# Altium schematic sheet Smokehouse_thermometer.SchDoc
size A4
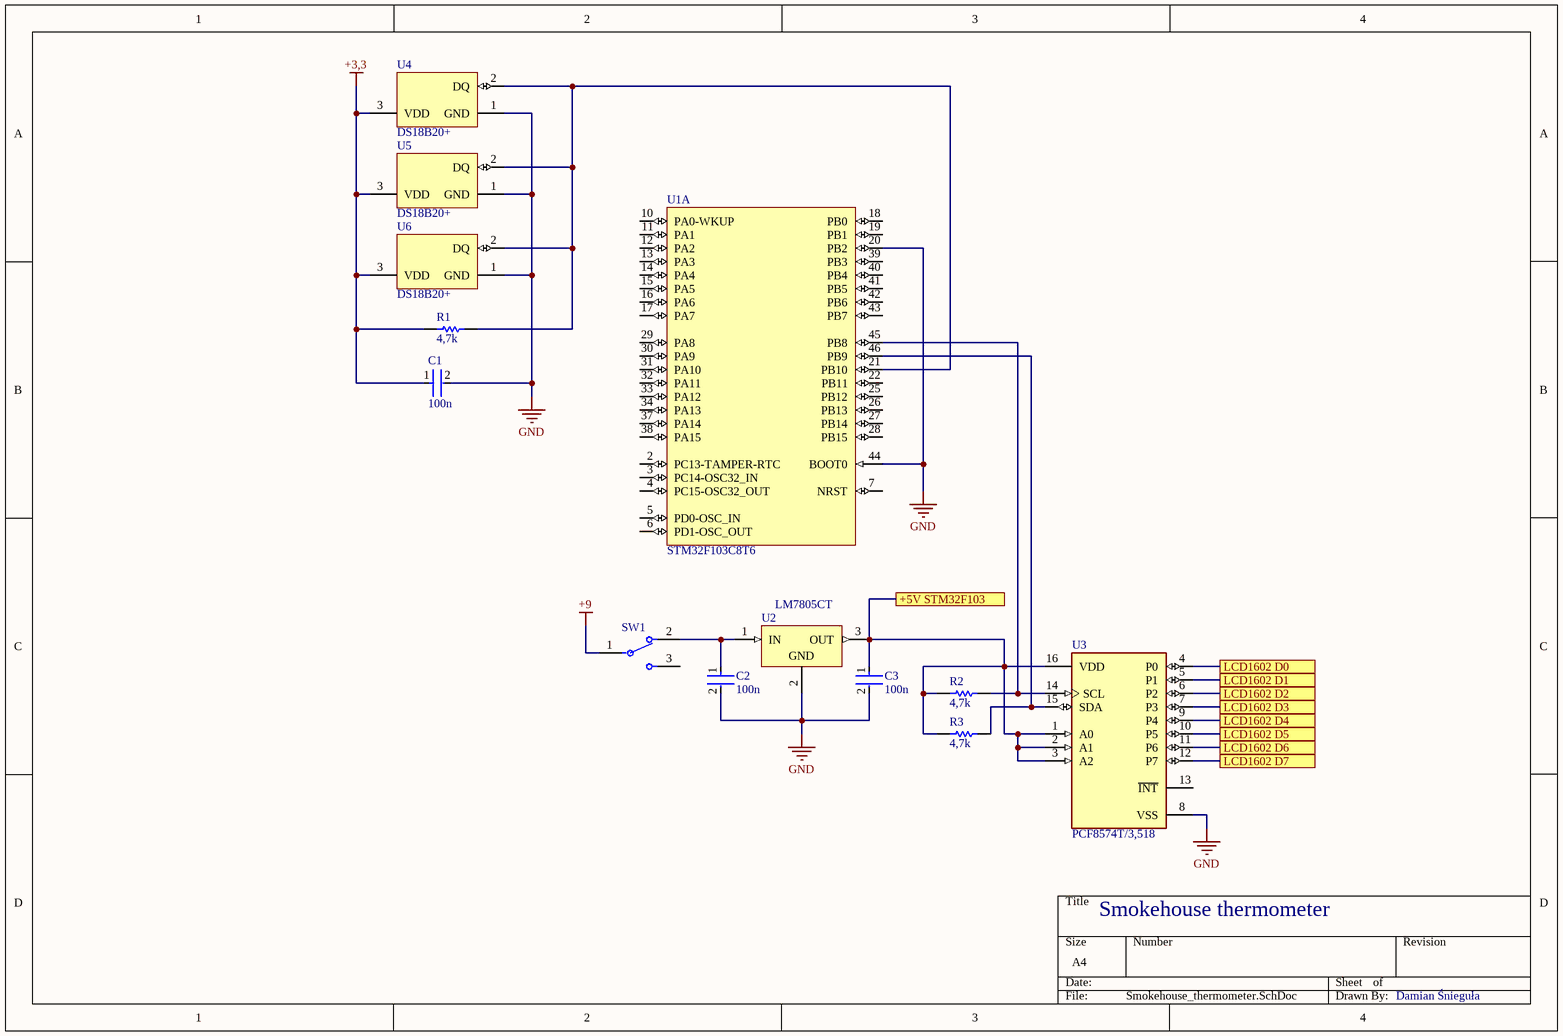
[diagram p0: Smokehouse_thermometer.SchDoc]

## Parts
C1  100n  [FP-C0402-BB-MFG]
C2  100n  [FP-C0402-BB-MFG]
C3  100n  [FP-C0402-BB-MFG]
R1  4,7k  [RESC1609X50X30NL8T20]
R2  4,7k  [RESC1609X50X30NL8T20]
R3  4,7k  [RESC1609X50X30NL8T20]
SW1  A105SYCB04  [FP-A105SYCB04-MFG]  (value not drawn)
U1  STM32F103C8T6  [STM-LQFP48_L]  (part A of 2)
U2  LM7805CT  [FAIR-TO-220-3]
U3  PCF8574T/3,518  [FP-SOT162-1-MFG]
U4  DS18B20+  [Q3+1]
U5  DS18B20+  [Q3+1]
U6  DS18B20+  [Q3+1]

## Ports
+5V STM32F103, LCD1602 D0, LCD1602 D1, LCD1602 D2, LCD1602 D3, LCD1602 D4, LCD1602 D5, LCD1602 D6, LCD1602 D7

## Nets
+3,3: C1.1 R1.1 U4.3(VDD) U5.3(VDD) U6.3(VDD)
+9: SW1.1
GND: C1.2 C2.2 C3.2 U1.20(PB2) U1.44(BOOT0) U2.2(GND) U3.8(VSS) U4.1(GND) U5.1(GND) U6.1(GND)
+5V STM32F103: C3.1 R2.1 R3.1 U2.3(OUT) U3.1(A0) U3.2(A1) U3.3(A2) U3.16(VDD) ; port +5V STM32F103
LCD1602 D0: U3.4(P0) ; port LCD1602 D0
LCD1602 D1: U3.5(P1) ; port LCD1602 D1
LCD1602 D2: U3.6(P2) ; port LCD1602 D2
LCD1602 D3: U3.7(P3) ; port LCD1602 D3
LCD1602 D4: U3.9(P4) ; port LCD1602 D4
LCD1602 D5: U3.10(P5) ; port LCD1602 D5
LCD1602 D6: U3.11(P6) ; port LCD1602 D6
LCD1602 D7: U3.12(P7) ; port LCD1602 D7
NetC2_1: C2.1 SW1.2 U2.1(IN)
NetR1_2: R1.2 U1.21(PB10) U4.2(DQ) U5.2(DQ) U6.2(DQ)
NetR2_2: R2.2 U1.45(PB8) U3.14(SCL)
NetR3_2: R3.2 U1.46(PB9) U3.15(SDA)

Not connected (* = marked no-connect by the designer): SW1 3; U1 2(PC13-TAMPER-RTC) 3(PC14-OSC32_IN) 4(PC15-OSC32_OUT) 5(PD0-OSC_IN) 6(PD1-OSC_OUT) 7(NRST) 10(PA0-WKUP) 11(PA1) 12(PA2) 13(PA3) 14(PA4) 15(PA5) 16(PA6) 17(PA7) 18(PB0) 19(PB1) 22(PB11) 25(PB12) 26(PB13) 27(PB14) 28(PB15) 29(PA8) 30(PA9) 31(PA10) 32(PA11) 33(PA12) 34(PA13) 37(PA14) 38(PA15) 39(PB3) 40(PB4) 41(PB5) 42(PB6) 43(PB7); U3 13(~{INT})

## Notes on the sheet
- Smokehouse thermometer
- Damian Śnieguła

## Library data of the parts
C1-C3 = CMP-2008-02046-2: CAP CER 0.1UF 10V X5R 0402; Manufacturer: Kemet; Manufacturer Part Number: C0402C104K8PACTU; Material: Ceramic; Capacitance: 0.10 μF; Temperature Coefficient: 15%; Description: C0402 0.10 μF X5R 10.00% 10 V; Tolerance: 0.1; Value: 0.10 μF; Package: C0402-BB; Temperature: -55°C to +125°C; ComponentLink2Description: Datasheet; Temperature Characteristic: X5R; Device Class L1: Passive Components; Height: 0.55mm; Lead Free: Yes; ComponentLink2URL: https://content.kemet.com/datasheets/KEM_C1002_X7R_SMD.pdf; Device Class L2: Capacitors; Temperature Range Low: -55°C; Temperature Range High: +125°C; RoHS: TRUE; Octopart: https://octopart.com/c0402c104k8pactu-kemet-140039; Automotive: No; Mouser Description: Capacitor 100 nF 10 VDC 0402; Category: Cap; Voltage Rating: 10 V; Digikey Description: CAP CER 0.1UF 10V X5R 0402; Ipc Land Pattern Name: CAPC10050X50; Device Class L3: Ceramic Capacitors
R1-R3 = CMP-2000-03816-5: Chip Resistor, 0 Ohm, Jumper, 100 mW, -55 to 155 degC, 0603 (1608 Metric), RoHS, Tape and Reel; Manufacturer: Vishay Semiconductor; Voltage Rating: 75 V; Package Quantity: 5000; DatasheetVersion: 06/2012; Min Operating Temperature: -55 degC; ComponentLink1URL: http://www.vishay.com/; Mounting Technology: Surface Mount; Height: 0.45 mm; ComponentLink1Description: Manufacturer URL; REACH SVHC: Unknown; PackageReference: 0603; Packaging: Tape and Reel; Max Operating Temperature: 155 degC; Mount: Surface Mount; ComponentLink2Description: Datasheet; PackageDescription: 2-Pin Surface Mount Device, Body 1.575 x 0.85 mm; Length: 1.55 mm; ComponentLink2URL: http://www.vishay.com/docs/20035/dcrcwe3.pdf; Pins: 2; RoHSCompliant: true
SW1 = CMP-03408-000016-1: SWITCH TOGGLE SPDT 0.4VA 20V; Power Rating: 400mW; Insulation Resistance: 30MR; Actuator Length: 10.41mm; Illumination Type: Illuminated; Contact Resistance: 10mR; Contact Current Rating: 400mA; Actuator Material: Phenolic; Contact Material: Copper; Termination: Solder; Throw Configuration: SPDT; Contact Plating: Gold; REACH SVHC: No SVHC; Series: Gemini A; Mount: Bushing; Package Quantity: 100; Voltage Rating (AC): 20V; Min Operating Temperature: -30°C; Max Voltage Rating (DC): 20V; Max Operating Temperature: 85°C; Flammability Rating: UL94 V-0; RoHS Compliant: Yes
U1 = CMP-0237-00215-3: ARM Cortex-M3 32-bit MCU, 64 KB Flash, 20 KB Internal RAM, 37 I/Os, 48-pin LQFP, -40 to 85 degC, Tray; Supply Voltage(Vcc) min (V): 2; Internal RAM Size (kB): 20; FLASH Size (Prog) (kB): 64; A/D Converter: 2x12-bit (10 Channel); I/Os (High Current): 37; Operating Frequency(F) (Processor speed) (MHz): 72; Core: ARM Cortex-M3; ComponentLink3Description: Package Specification; Mounting Technology: Surface Mount; PartNumber: STM32F103C8T6; PackageReference: LQFP48; Packing: Tray; ComponentLink3URL: http://www.st.com/st-web-ui/static/active/en/resource/technical/document/datasheet/DM00058181.pdf; DatasheetVersion: Rev. 16; ComponentLink1URL: http://www.st.com/web/en/home.html; PackageVersion: Rev. 6, 06/2013; ComponentLink2URL: http://www.st.com/st-web-ui/static/active/en/resource/technical/document/datasheet/CD00161566.pdf; ComponentLink1Description: Manufacturer URL; ComponentLink2Description: Datasheet; PackageDescription: 48-Pin Low Profile Quad Flat Package, 7 x 7 mm Body, 0.5 mm Pitch
U2 = CMP-2000-04938-1: Positive Voltage Regulator, 5 V, 1 A, -40 to 125 degC, 3-Pin TO-220, RoHS, Tube; Manufacturer: FairchildSemiconductor; Maximum Input Voltage: 35V; Maximum Quiescent Current: 8mA; Load Regulation: 100mV; Maximum Output Current: 2.2(Typ)A; Output Type: Fixed; Typical Dropout Voltage @ Current: 2@1AV; Rad Hard: No; Output Voltage: 5V; Accuracy: ±4%; Number of Outputs: 1; Category: LinearRegulator; Package Description: 3-Pin Through Hole Device, Body 10 x 4.5 mm, Pitch 2.54 mm; Packaging: Rail/Tube; Mounting: ThroughHole; Polarity: Positive; Manufacturer URL: https://www.fairchildsemi.com/; Line Regulation: 100mV; Datasheet Version: Aug-12; Datasheet URL: https://datasheet.ciiva.com/26904/lm7805ct-26904988.pdf; Package Reference: TO-220; Package URL: https://www.fairchildsemi.com/package-drawings/TO/TO220B03.pdf; Package: 3TO-220AB; Operating Temperature: -40to125degC; Type: Linear
U3 = CMP-10112-000010-1: IC I/O EXPANDER I2C 8B 16SOIC; Manufacturer: NXP Semiconductors; Frequency: 100kHz; Description: I/O Expander 8 I²C 100kHz 16-SO; Max Supply Voltage: 6V; Standoff Height: 0.1mm; Nominal Supply Current: 40uA; Max Junction Temp: +125°C; Min Supply Voltage: 2.5V; Number Of I/Os: 8; Manufacturer Part Number: PCF8574T/3,518; Footprint Url: https://www.nxp.com/docs/en/package-information/SOT162-1.pdf; ComponentLink2URL: https://www.nxp.com/docs/en/data-sheet/PCF8574_PCF8574A.pdf; Automotive: No; Digikey Description: IC I/O EXPANDER I2C 8B 16SOIC; Mouser Description: PCF8574 Series 2.5 - 6V Remote 8-bit I/O Expander for I2C-bus - SOIC-16; Ipc Land Pattern Name: SOIC127P1032X265-16; Interface: I2C; Octopart: https://octopart.com/pcf8574t%2F3%2C518-nxp+semiconductors-10470852; Ambient Temperature Range Low: -40°C; Lead Free: Yes; Device Class L2: Interface ICs; Temperature Range High: +85°C; Device Class L1: Integrated Circuits (ICs); Package: SOT162-1; ComponentLink2Description: Datasheet; Device Class L3: I/O Expanders; Temperature: -40°C to +85°C; Ambient Temperature Range High: +85°C; Height: 2.65mm; Category: IC; RoHS: TRUE; Temperature Range Low: -40°C
U4-U6 = CMP-0253-00003-1: Programmable Resolution Digital Thermometer, 1-Wire Interface, ±0.5°C Accuracy, 3-Pin TO92, -55°C to +125°C, Pb-Free; ComponentLink2URL: http://datasheets.maxim-ic.com/en/ds/DS18B20.pdf; PackageReference: Q3+1; ComponentLink1Description: Manufacturer URL; PackageDescription: TO-92 Package, Body Dia. 4.7mm; Leads 0.51 x 0.51 mm (max), Pb-Free; DatasheetVersion: 2007; Code_JEDEC: TO-226-AA; ComponentLink1URL: http://www.maxim-ic.com; PackageVersion: revB, 2009; ComponentLink2Description: Datasheet